# EAGLE schematic schematic (EAGLE 7.3.0)
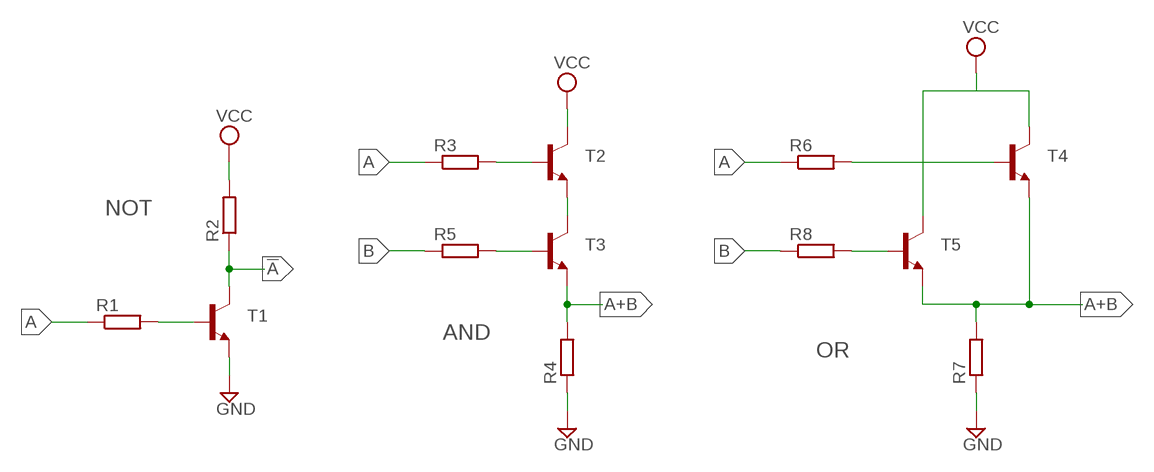
[diagram p0: schematic, sheet 1]

## Parts
R1  R0204/7  [0204/7]
R2  R0204/7  [0204/7]
R3  R0204/7  [0204/7]
R4  R0204/7  [0204/7]
R5  R0204/7  [0204/7]
R6  R0204/7  [0204/7]
R7  R0204/7  [0204/7]
R8  R0204/7  [0204/7]
T1  2N3904  [TO92]
T2  2N3904  [TO92]
T3  2N3904  [TO92]
T4  2N3904  [TO92]
T5  2N3904  [TO92]

## Nets
!A: R2.1 T1.1(C)
A: R1.1 R3.1 R6.1
A+B: R4.2 R7.2 T3.3(E) T4.3(E) T5.3(E)
B: R5.1 R8.1
GND: R4.1 R7.1 T1.3(E)
N$1: R6.2 T4.2(B)
N$2: R1.2 T1.2(B)
N$3: R8.2 T5.2(B)
N$4: R5.2 T3.2(B)
N$5: R3.2 T2.2(B)
N$6: T2.3(E) T3.1(C)
VCC: R2.2 T2.1(C) T4.1(C) T5.1(C)

## Notes on the sheet
- NOT
- AND
- OR

## Library data of the parts
R1-R8 = eagle-ltspice:R: RESISTOR, European symbol; SPICEMODEL: NONE; SPICEPREFIX: R
T1-T5 = transistor:2N3904: NPN TRANSISTOR